# EAGLE design Z05_CC_SHIELD_01 (EAGLE 6.3)
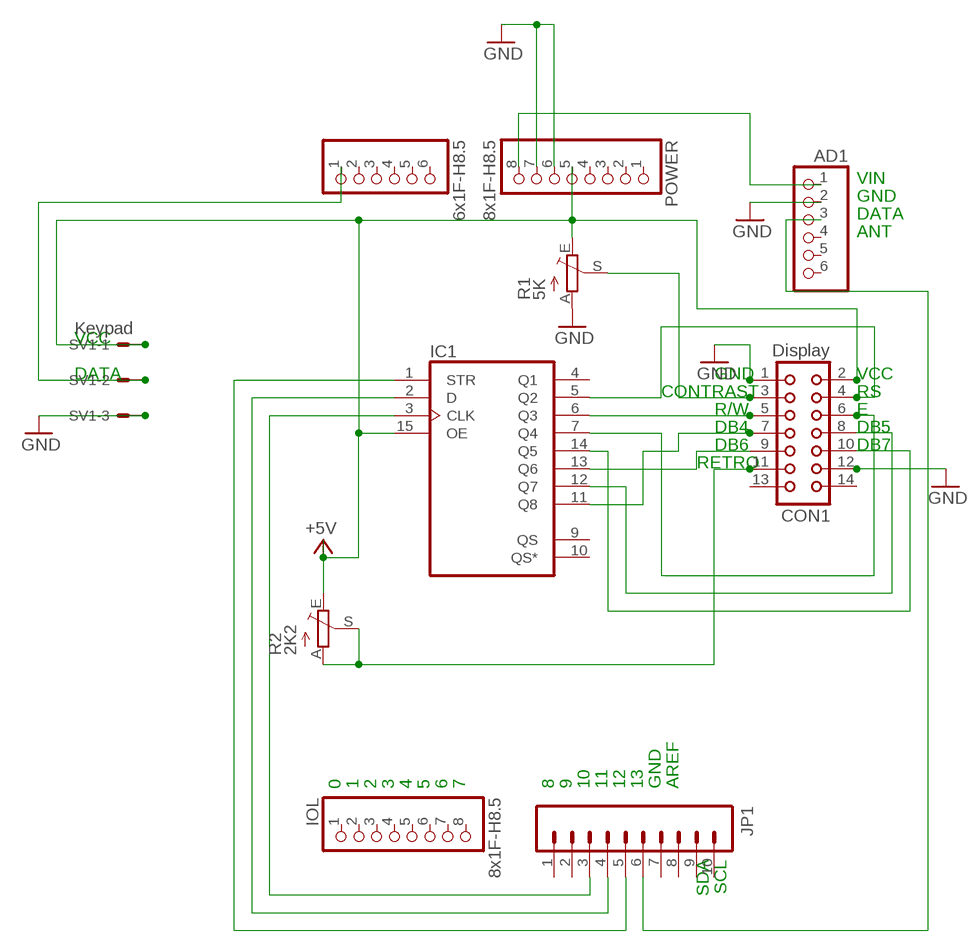
[diagram p0: schematic, sheet 1]

## Parts
AD  6x1F-H8.5  PINHD-1X6  [1X06]
AD1  6x1F-H8.5  PINHD-1X6  [1X06]
CON1  Display  CON14  [CON14]
IC1  4094N  [DIL16]
IOL  8x1F-H8.5  PINHD-1X8  [1X08]
JP1  M10"  [1X10]
POWER  8x1F-H8.5  PINHD-1X8  [1X08]
R1  5K  TRIM_EU-LI10  [LI10]
R2  2K2  TRIM_EU-LI10  [LI10]
SV1  Keypad  22-05-7058-05  [7395-05]

## Nets
+5V [usbvcc]: CON1.2 IC1.15(OE) POWER.5 R1.E R2.E SV1.1
A5: AD.1 SV1.2
GND [gnd]: AD1.2 CON1.1 CON1.12 POWER.6 POWER.7 R1.A SV1.3
N$1: CON1.11 R2.A R2.S
N$3: AD1.3 JP1.6
N$4: CON1.3 R1.S
N$5: IC1.1(STR) JP1.5
N$6: IC1.2(D) JP1.4
N$7: IC1.3(CLK) JP1.3
N$8: CON1.4 IC1.5(Q2)
N$9: CON1.5 IC1.6(Q3)
N$10: CON1.6 IC1.7(Q4)
N$11: CON1.7 IC1.11(Q8)
N$12: CON1.8 IC1.12(Q7)
N$13: CON1.9 IC1.13(Q6)
N$14: CON1.10 IC1.14(Q5)
VIN: AD1.1 POWER.8
Unconnected: AD1.4 AD1.5 AD1.6 AD.2 AD.3 AD.4 AD.5 AD.6 CON1.13 CON1.14 IC1.4(Q1) IC1.9(QS) IC1.10(QS*) IOL.1 IOL.2 IOL.3 IOL.4 IOL.5 IOL.6 IOL.7 IOL.8 JP1.1 JP1.2 JP1.7 JP1.8 JP1.9 JP1.10 POWER.1 POWER.2 POWER.3 POWER.4 SV1.4 SV1.5

## Notes on the sheet
- VIN
- GND
- DATA
- ANT
- VCC
- DATA | GND | VCC
- CONTRAST | RS
- R/W | E
- DB4 | DB5
- DB6 | DB7
- RETRO
- 0 | 1 | 2 | 3 | 4 | 5 | 6 | 7 | 8 | 9 | 10 | 11 | 12 | 13 | GND | AREF
- SDA | SCL

## Power pins joined to a net without a drawn wire
VDD: IC1.16(VDD)
VSS: IC1.8(VSS)

## Library data of the parts
AD AD1 = SmartPrj:PINHD-1X6: PIN HEADER
CON1 = con-harting:CON14: CONNECTOR; OC_FARNELL: unknown; OC_NEWARK: unknown
IC1 = 40xx:4094: 8-stage SHIFT/STORE REGISTER, tri-state
IOL POWER = SmartPrj:PINHD-1X8: PIN HEADER
JP1 = SparkFun-Connectors:M10: Header 10 Standard 10-pin 0.1" header. Use with straight break away headers (SKU : PRT-00116), right angle break away headers (PRT-00553), swiss pins (PRT-00743), machine pins (PRT-00117), and female headers (PRT-00115).
R1 R2 = pot:TRIM_EU-: POTENTIOMETER
SV1 = con-molex:22-?-05: CONNECTOR wire to board 2.54 mm (.1 inch) pitch header; OC_FARNELL: unknown; OC_NEWARK: unknown

## Net classes
0 default: width 0.254 mm, clearance 0.254 mm
1 power: width 0.61 mm, drill 0.61 mm, clearance 0.254 mm
2 gnd: width 0.305 mm, drill 0.559 mm, clearance 0.254 mm
3 usbvcc: width 0.508 mm, drill 0.61 mm, clearance 0.254 mm
4 aref: width 0.406 mm, drill 0.61 mm, clearance 0.254 mm

## Board
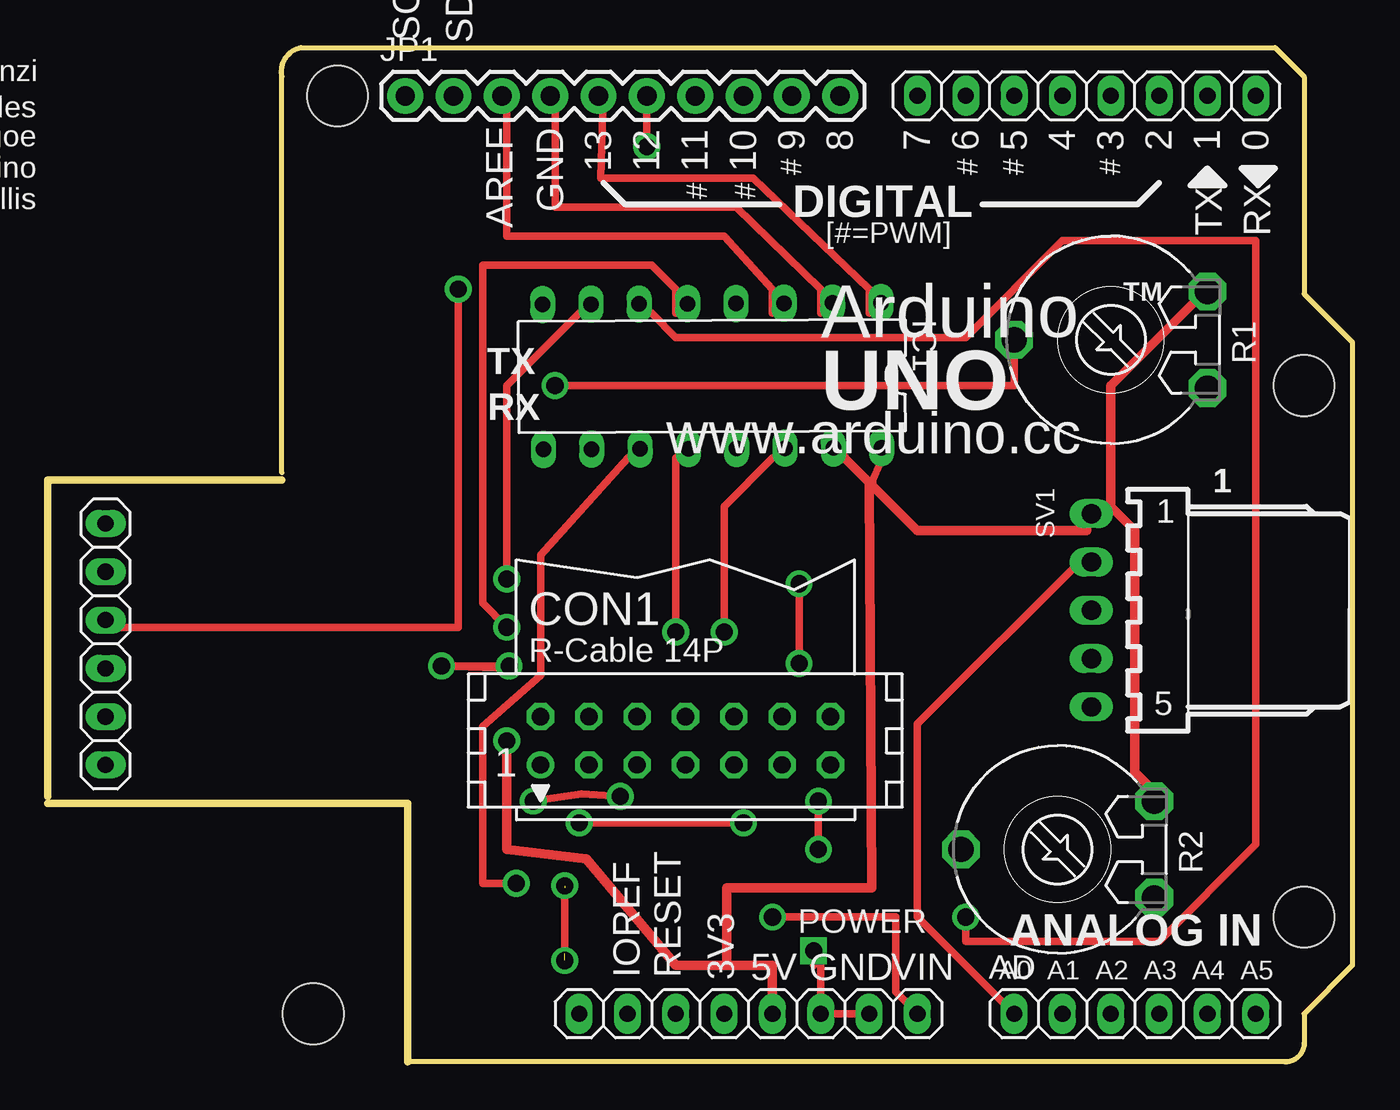
[diagram p1: board, top side]
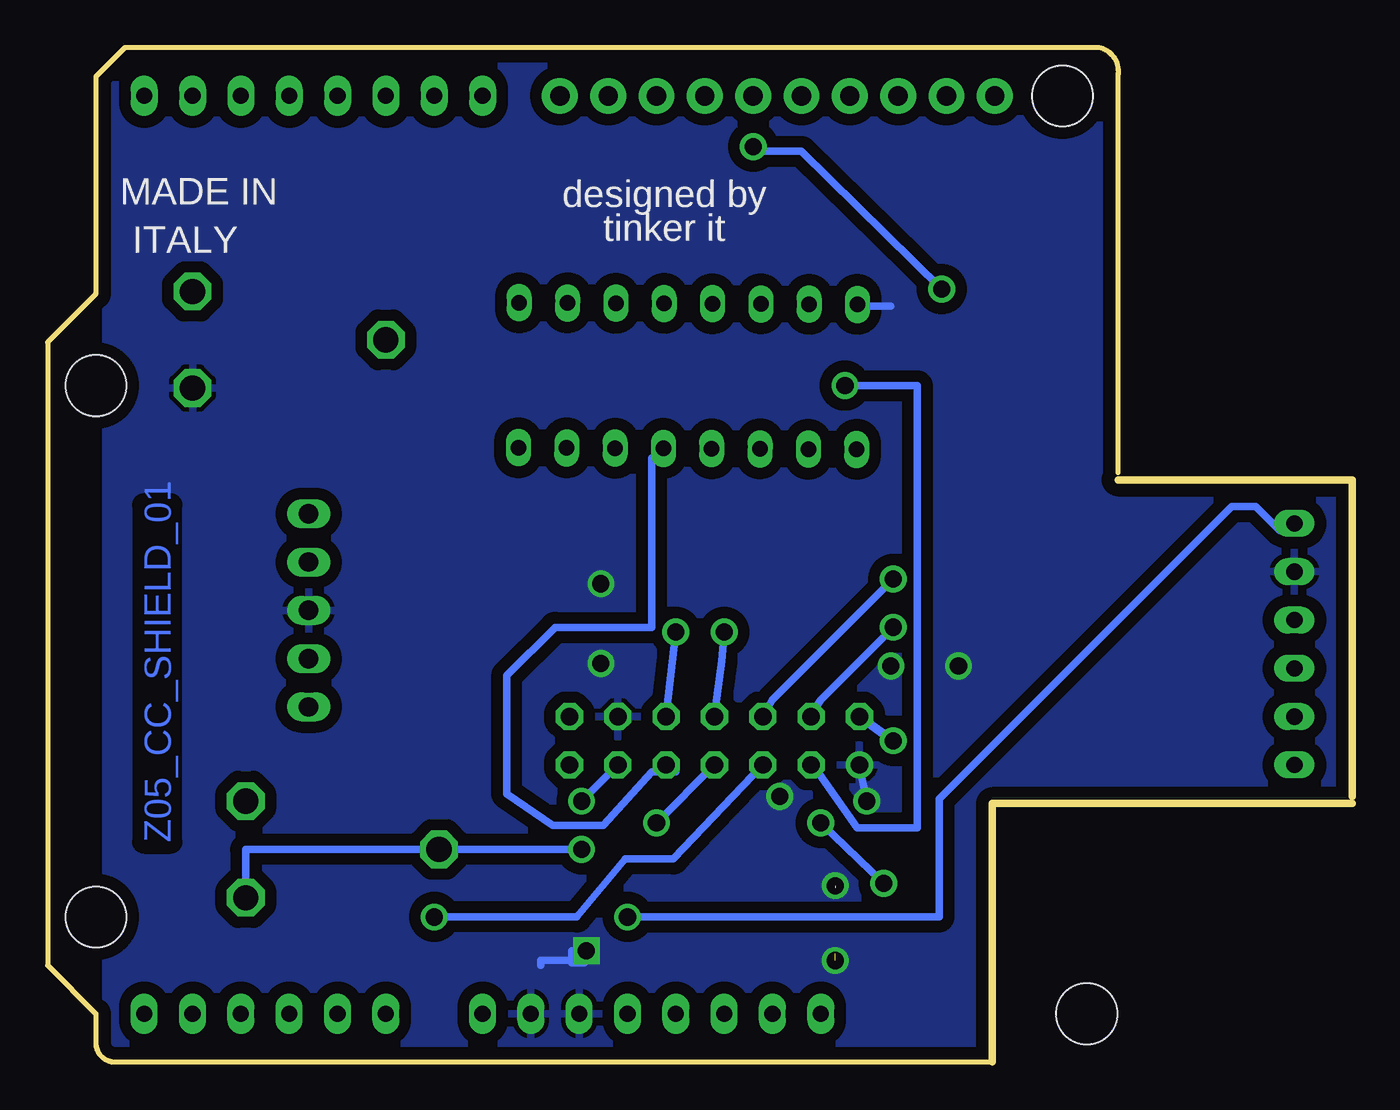
[diagram p2: board, bottom side, seen from below]

Size 68.58 x 53.34 mm. Coordinates in mm from the lower left corner, seen from the top.
Outline: 12.32,30.97 12.32,51.83 arc-90 13.32,53.34 64.52,53.34 66.04,51.82 66.04,40.39 68.58,37.85 68.58,5.08 66.04,2.54 66.04,1 arc-90 65.04,0 18.92,0 18.92,13.59 0,13.59
Outline: 12.32,30.61 0,30.61 0,13.97
Copper layers (1*16): Top 0.035mm / dielectric 1.5mm / Bottom 0.035mm
Design rules "default *": minimum track width 16mil, minimum drill 22mil, track to track 16mil, track to pad 12mil, pad to pad 12mil, via to via 12mil, smd to smd 8mil, copper to edge 26mil, drill to drill 12mil, minimum pad ring 10mil, minimum via ring 10mil, stop-mask expansion 1mil, vias tented up to drill 30mil, thermal gap 10mil
Holes 3.2 mm at 66.04,35.56 66.04,7.62 15.24,50.8 13.97,2.54
vRestrict: area 22.9,44.1 to 24.6,49.1; area 25.4,45.5 to 27.1,49.1; area 28.4,45.3 to 29.6,48.8; area 31,45.3 to 32.1,48.8; area 33.5,45.3 to 34.7,48.8; area 36.1,45.3 to 37.2,48.8; area 38.7,47.2 to 39.9,48.8; area 40.3,45.1 to 47.6,46.9; area 60.3,44.2 to 61.7,46.7; area 62.9,44.2 to 64.3,46.7; area 61.3,35.8 to 64.8,37.2; area 0.6,21.8 to 2,30.1; 14 more areas

### Footprints (pad centres in the part's own frame; a part is rotated, then mirrored left to right if it is on the bottom)
1X06 = drill 0.85 pad 1.422 long: 1 -6.35,0; 2 -3.81,0; 3 -1.27,0; 4 1.27,0; 5 3.81,0; 6 6.35,0
CON14 = drill 0.914: 1 -7.62,-1.27 | drill 0.914 octagon: 2 -7.62,1.27; 3 -5.08,-1.27; 4 -5.08,1.27; 5 -2.54,-1.27; 6 -2.54,1.27; 7 0,-1.27; 8 0,1.27; 9 2.54,-1.27; 10 2.54,1.27; 11 5.08,-1.27; 12 5.08,1.27; 13 7.62,-1.27; 14 7.62,1.27
DIL16 = drill 0.813 long: 1 -8.89,-3.81; 2 -6.35,-3.81; 3 -3.81,-3.81; 4 -1.27,-3.81; 5 1.27,-3.81; 6 3.81,-3.81; 7 6.35,-3.81; 8 8.89,-3.81; 9 8.89,3.81; 10 6.35,3.81; 11 3.81,3.81; 12 1.27,3.81; 13 -1.27,3.81; 14 -3.81,3.81; 15 -6.35,3.81; 16 -8.89,3.81
1X08 = drill 0.85 pad 1.422 long: 1 -8.89,0; 2 -6.35,0; 3 -3.81,0; 4 -1.27,0; 5 1.27,0; 6 3.81,0; 7 6.35,0; 8 8.89,0
1X10 = drill 1.016 pad 1.88: 1 0,0; 2 2.54,0; 3 5.08,0; 4 7.62,0; 5 10.16,0; 6 12.7,0; 7 15.24,0; 8 17.78,0; 9 20.32,0; 10 22.86,0
LI10 = drill 1.321 octagon: A -2.54,-5.08; E 2.54,-5.08; S 0,5.08
7395-05 = drill 1.016 long: 1 5.08,0; 2 2.54,0; 3 0,0; 4 -2.54,0; 5 -5.08,0

### Placement (x,y rotation side)
AD  57.15,2.54 0 top
AD1  3.05,21.97 270 top
CON1  33.53,16.89 0 top
IC1  34.92,36.07 180.3 top
IOL  54.61,50.8 180 top
JP1  18.8,50.8 0 top
POWER  36.83,2.54 0 top
R1  55.88,37.97 90 top
R2  53.09,11.18 90 top
SV1  54.86,23.75 90 top

### Tracks (layer width: path | path; a pad name or v marks a point on that pad's centre or on a via)
+5V  (via drill 0.9)
  Top 0.406: 43.81,32.26 43.81,31.62 43.31,30.48
  Top 0.508: v24.13,16.89 24.13,11.18 28.32,10.67 33.02,5.08 35.69,5.08 | 35.69,5.08 38.1,5.08 POWER.5 | 43.18,30.48 45.72,27.94 54.61,27.94 54.61,29.21 SV1.1 55.88,29.21 | 43.18,30.48 41.91,31.75 IC1.15 | 55.88,29.21 57.15,27.94 57.15,15.24 58.42,13.97 R2.E | 55.88,29.21 55.88,35.56 60.96,40.64 R1.E | 35.69,5.08 35.69,9.14 43.31,9.14 43.18,30.48 | 43.18,30.48 43.31,30.48
  Bottom 0.508: v24.13,16.89 CON1.2
A5
  Top 0.406: AD.1 45.72,7.62 45.72,17.78 54.61,26.67 SV1.2
GND  (via drill 0.9)  (2 unrouted)
  Top 0.406: POWER.6 40.64,5.33 | POWER.7 40.77,2.54 | v39.5,25.15 v39.5,20.95 | v20.7,20.83 24.26,20.7 | 20.57,20.83 v20.7,20.83 | v20.7,20.83 v24.26,20.83 | v25.53,13.72 28.07,14.1 v30.1,13.97 | 27.18,9.14 27.18,5.71 | v40.26,5.84 40.26,5.08
  Bottom 0.406: v25.53,13.72 CON1.1 | 40.51,5.33 42.67,5.33 42.67,5.08 | 40.39,5.21 41.02,5.21 41.02,5.84 v40.26,5.84 | 25.65,39.75 24.26,39.75 | 30.48,13.97 v30.1,13.97
  other vias: 27.18,9.27 27.18,5.33
  pour Bottom (isolate 0.61): 12.83,52.7 65.66,52.7 65.79,52.2 65.53,52.2 65.53,0.38 19.3,0.38 19.3,13.97 0.64,13.97 0.64,29.97 12.7,29.97 12.7,30.1 12.57,30.1 12.57,52.96 12.7,52.96 12.7,52.58
N$1  (via drill 0.9)
  Top 0.406: v40.51,13.72 v40.51,11.18
  Bottom 0.406: CON1.11 v40.51,13.72 | v40.51,11.18 R2.S 58.17,11.18 R2.A
N$3  (via drill 0.9)
  Top 0.406: v21.59,40.64 21.59,22.86 3.81,22.86 AD1.3 | v31.5,48.13 JP1.6
  Bottom 0.406: v31.5,48.13 31.24,47.88 28.96,47.88 v21.59,40.64
N$4  (via drill 0.9)
  Top 0.406: v26.67,35.56 50.8,35.56 R1.S 50.8,38.1
  Bottom 0.406: v26.67,35.56 22.86,35.56 22.86,12.32 26.04,12.32 28.38,15.68 28.45,15.75 CON1.3
N$5
  Top 0.406: IC1.1 43.18,39.37 43.18,40.64 37.08,46.48 29.08,46.48 29.21,50.8 JP1.5
N$6
  Top 0.406: IC1.2 40.64,39.37 40.64,40.64 36.2,44.96 26.67,44.96 26.67,50.8 JP1.4
N$7
  Top 0.406: IC1.3 38.1,39.37 38.1,40.64 35.56,43.43 24.13,43.43 24.13,50.8 JP1.3
N$8  (via drill 0.9)
  Top 0.406: v24.13,22.86 22.86,24.13 22.86,41.91 31.75,41.91 33.02,40.64 33.02,39.37 IC1.5
  Bottom 0.406: v24.13,22.86 27.94,19.05 28.45,18.29 CON1.4
N$9  (via drill 0.9)
  Top 0.406: v48.26,7.62 48.26,6.35 58.42,6.35 63.5,11.43 63.5,43.18 53.34,43.18 48.26,38.1 33.02,38.1 31.75,39.37 IC1.6
  Bottom 0.406: v48.26,7.62 40.77,7.62 38.23,10.67 35.69,10.67 CON1.5
N$10  (via drill 0.9)
  Top 0.406: v24.13,25.4 24.13,35.56 27.94,39.37 IC1.7
  Bottom 0.406: v24.13,25.4 30.48,19.05 CON1.6
N$11  (via drill 0.9)
  Top 0.406: v24.64,9.4 22.86,9.4 22.86,17.65 25.91,20.32 25.91,26.67 30.48,31.75 IC1.11 | v36.58,12.57 v27.94,12.57
  Bottom 0.406: v27.94,12.57 v24.64,9.4 | CON1.7 v36.58,12.57
N$12  (via drill 0.9)
  Top 0.406: v33.02,22.61 33.02,31.75 IC1.12
  Bottom 0.406: v33.02,22.61 33.15,21.08 CON1.8
N$13
  Bottom 0.406: IC1.13 36.83,31.75 36.83,22.86 41.91,22.86 44.45,20.32 44.45,14.1 42.04,12.45 39.37,12.45 36.83,15.24 35.56,15.24 CON1.9
N$14  (via drill 0.9)
  Top 0.406: v35.56,22.61 35.56,29.21 38.1,31.75 IC1.14
  Bottom 0.406: v35.56,22.61 36.07,18.29 CON1.10
VIN  (via drill 0.9)
  Top 0.406: v38.1,7.62 44.58,7.62 44.58,3.68 POWER.8
  Bottom 0.406: v38.1,7.62 21.72,7.62 21.72,13.84 6.35,29.21 5.08,29.21 3.81,27.94 AD1.1

### Text on the board
Bottom: Z05_CC_SHIELD_01
tPlace: 13 | 12 | 11 | 10 | 9 | 8 | 7 | 6 | 5 | 4 | 3 | 2 | 1 | 0
tNames: SCL | SDA | M.Banzi | D.Cuartielles | T.Igoe | AREF | GND | G.Martino | # | # | # | # | D.Mellis | # | # | DIGITAL | [#=PWM] | TX | RX | TM | TX | Arduino | RX | UNO | www.arduino.cc | 1 | ANALOG IN | IOREF | RESET | 3V3 | 5V | GND | VIN | A0 | A1 | A2 | A3 | A4 | A5
bNames: MADE IN | designed by | MADE IN | ITALY | tinker it | ITALY | designed by | tinker it | ATMEGA328
ReferenceLC: L | TX | ON | RX | PC1 | PC2
214bmp: D:/SmartProjects/Snc/a4_bn_logo2.bmp